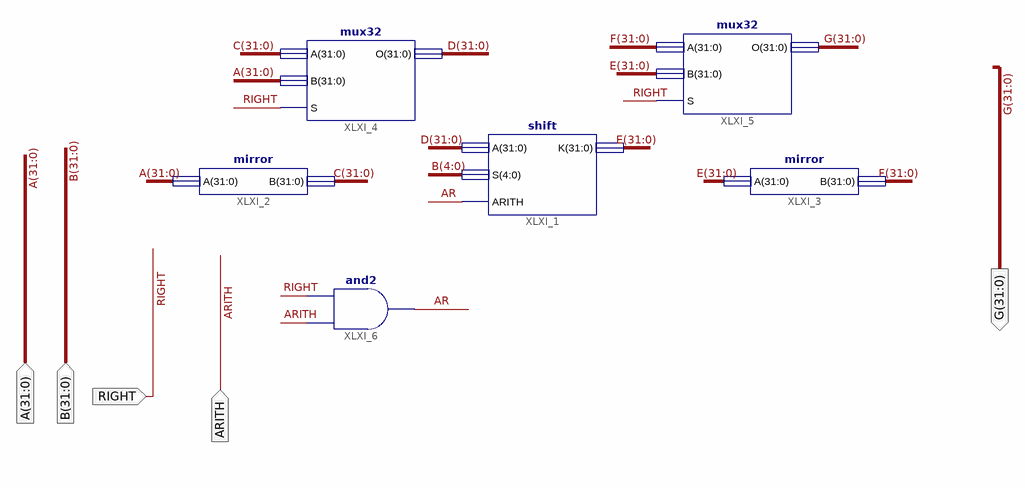
[diagram p0: schematic sheet 1]
// Xilinx ISE schematic shiftLR.sch (artix7) as structural Verilog: 6 symbols, 5 ports
module shiftLR (
  input  [31:0] A,
  input  [31:0] B,
  input  RIGHT,
  input  ARITH,
  output [31:0] G
);

  wire AR;
  wire [31:0] C, D, E, F;

  shift XLXI_1 (.A(D), .S(B[4:0]), .ARITH(AR), .K(E));
  mirror XLXI_2 (.A(A), .B(C));
  mirror XLXI_3 (.A(E), .B(F));
  mux32 XLXI_4 (.A(C), .B(A), .S(RIGHT), .O(D));
  mux32 XLXI_5 (.A(F), .B(E), .S(RIGHT), .O(G));
  and XLXI_6 (AR, ARITH, RIGHT);
endmodule
